# Altium schematic sheet mems.SchDoc
size 431 x 279 mm; Organization: ORGANIZATION; Address1: ADDRESS 1; Address2: ADDRESS 2; Address3: ADDRESS 3; Address4: ADDRESS 4; Revision: -; SheetNumber: 1; SheetTotal: 4; ENG_APP_DATE: --/--/--; DSN_APP_DATE: --/--/--; CHK_APP_DATE: --/--/--
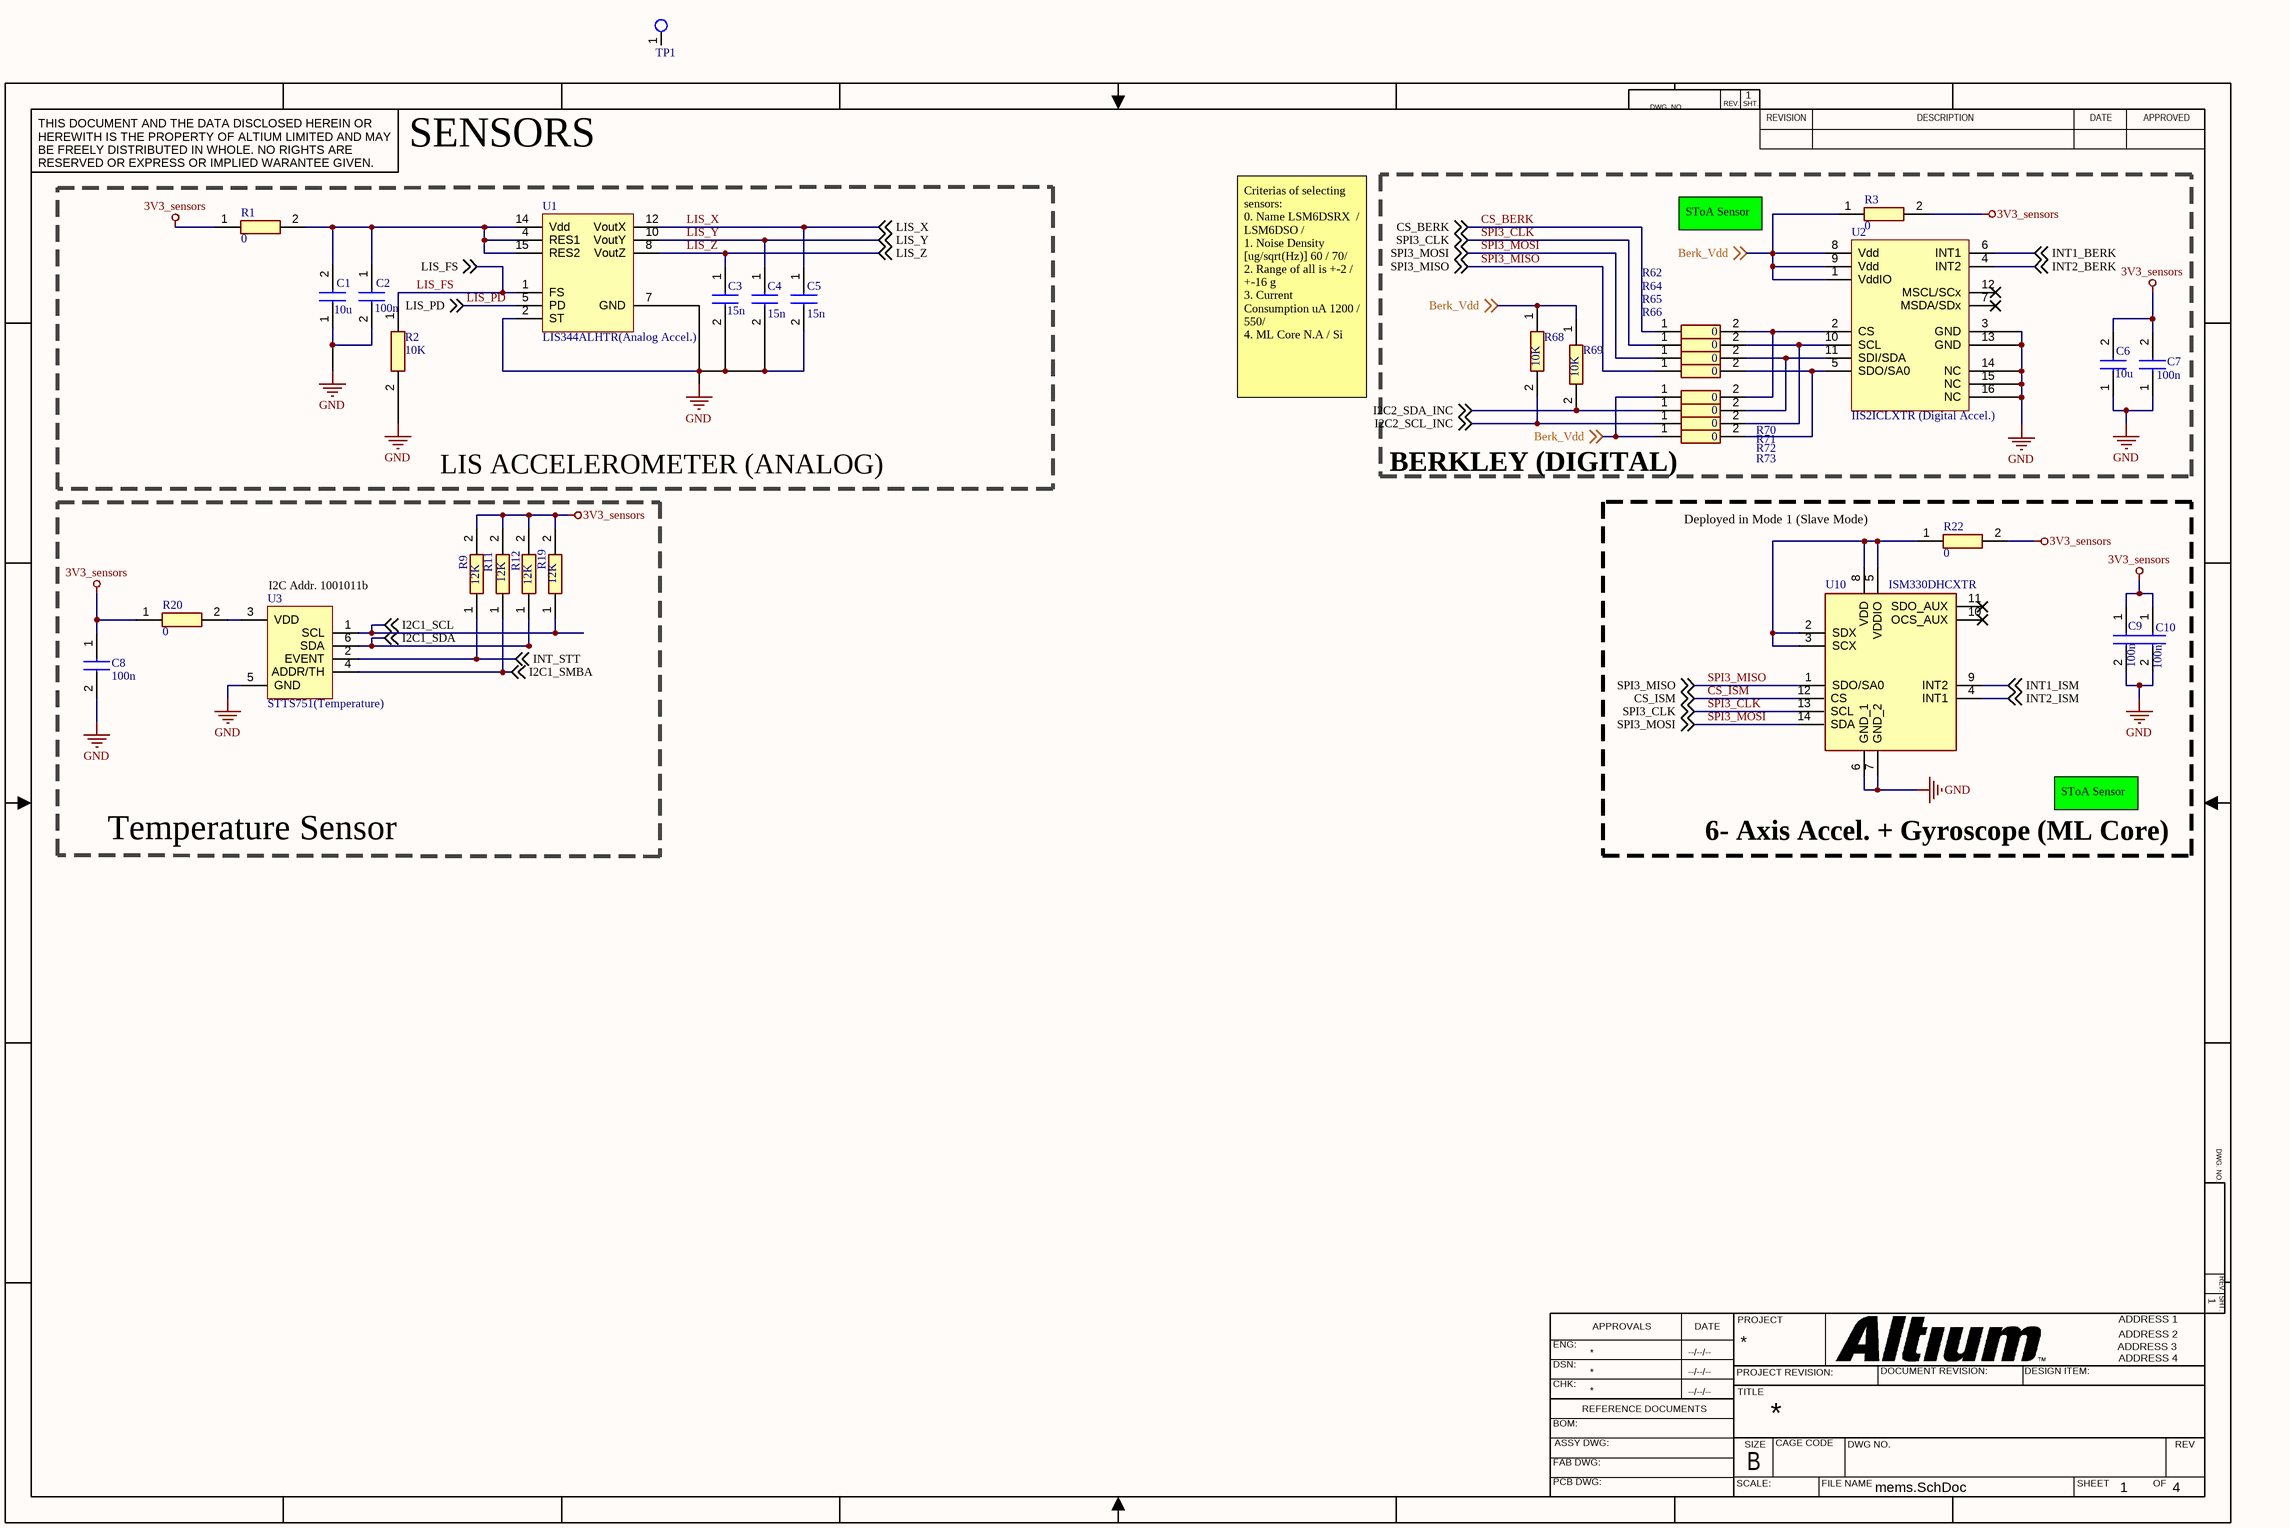
[diagram p0: mems.SchDoc]

## Parts
C1  10u  [CAPC1608X100N]
C2  100n  [CAPC1608X87N]
C3  15n  [CAPC1608X87N]
C4  15n  [CAPC1608X87N]
C5  15n  [CAPC1608X87N]
C6  10u  [CAPC1608X100N]
C7  100n  [CAPC1608X87N]
C8  100n  [CAPC1608X87N]
C9  100n  [CAPC1608X87N]
C10  100n  [CAPC1608X87N]
R1  0  [RESC1608X55N]
R2  10K  [ERJ3EK_(0603)]
R3  0  [RESC1608X55N]
R9  12K  [RESC0603X26N]
R11  12K  [RESC0603X26N]
R12  12K  [RESC0603X26N]
R19  12K  [RESC0603X26N]
R20  0  [RESC1608X55N]
R22  0  [RESC1608X55N]
R62  0  [RESC1608X55N]
R64  0  [RESC1608X55N]
R65  0  [RESC1608X55N]
R66  0  [RESC1608X55N]
R68  10K  [ERJ3EK_(0603)]
R69  10K  [ERJ3EK_(0603)]
R70  0  [RESC1608X55N]
R71  0  [RESC1608X55N]
R72  0  [RESC1608X55N]
R73  0  [RESC1608X55N]
TP1  test_point  [test_point]  (value not drawn)  (no BOM)
U1  LIS344ALHTR(Analog Accel.)  [LGA16R65P4X4_400X400X160]
U2  IIS2ICLXTR (Digital Accel.)  [Berkley]
U3  STTS751(Temperature)  [SOT95P280X145-6N]
U10  ISM330DHCXTR  [LGA-14(2.5X3X0.86)]

## Blocks framed on the sheet
LIS ACCELEROMETER (ANALOG): C1-C5 R1 R2 U1
BERKLEY (DIGITAL): C6 C7 R3 R62 R64-R66 R68-R73 U2
Temperature Sensor: C8 R9 R11 R12 R19 R20 U3
6- Axis Accel. + Gyroscope (ML Core): C9 C10 R22 U10

## Nets
3V3_sensors: C6.2 C7.2 C8.1 C9.1 C10.1 R1.1 R3.2 R9.2 R11.2 R12.2 R19.2 R20.1 R22.2
GND: C1.1 C2.2 C3.2 C4.2 C5.2 C6.1 C7.1 C8.2 C9.2 C10.2 R2.2 U1.2(ST) U1.7(GND) U2.3(GND) U2.13(GND) U2.14(NC) U2.15(NC) U2.16(NC) U3.5(GND) U10.6(GND_1) U10.7(GND_2)
Berk_Vdd: R3.1 R68.1 R69.1 R70.1 R73.1 U2.1(VddIO) U2.8(Vdd) U2.9(Vdd) ; off-sheet Berk_Vdd
CS_BERK: R62.1 ; off-sheet CS_BERK
CS_ISM: U10.12(CS) ; off-sheet CS_ISM
I2C1_SCL: R19.1 U3.1(SCL) ; off-sheet I2C1_SCL
I2C1_SDA: R12.1 U3.6(SDA) ; off-sheet I2C1_SDA
I2C1_SMBA: R11.1 U3.4(ADDR/TH) ; off-sheet I2C1_SMBA
I2C2_SCL_INC: R68.2 R72.1 ; off-sheet I2C2_SCL_INC
I2C2_SDA_INC: R69.2 R71.1 ; off-sheet I2C2_SDA_INC
INT1_BERK: U2.6(INT1) ; off-sheet INT1_BERK
INT1_ISM: U10.9(INT2) ; off-sheet INT1_ISM
INT2_BERK: U2.4(INT2) ; off-sheet INT2_BERK
INT2_ISM: U10.4(INT1) ; off-sheet INT2_ISM
INT_STT: R9.1 U3.2(EVENT) ; off-sheet INT_STT
LIS_FS: R2.1 U1.1(FS) ; off-sheet LIS_FS
LIS_PD: U1.5(PD) ; off-sheet LIS_PD
LIS_X: C5.1 U1.12(VoutX) ; off-sheet LIS_X
LIS_Y: C4.1 U1.10(VoutY) ; off-sheet LIS_Y
LIS_Z: C3.1 U1.8(VoutZ) ; off-sheet LIS_Z
SPI3_CLK: R64.1 U10.13(SCL) ; off-sheet SPI3_CLK
SPI3_MISO: R66.1 U10.1(SDO/SA0) ; off-sheet SPI3_MISO
SPI3_MOSI: R65.1 U10.14(SDA) ; off-sheet SPI3_MOSI
NetC1_2: C1.2 C2.1 R1.2 U1.4(RES1) U1.14(Vdd) U1.15(RES2)
NetR20_2: R20.2 U3.3(VDD)
NetR22_1: R22.1 U10.2(SDX) U10.3(SCX) U10.5(VDDIO) U10.8(VDD)
NetR62_2: R62.2 R70.2 U2.2(CS)
NetR64_2: R64.2 R72.2 U2.10(SCL)
NetR65_2: R65.2 R71.2 U2.11(SDI/SDA)
NetR66_2: R66.2 R73.2 U2.5(SDO/SA0)

Not connected (* = marked no-connect by the designer): TP1 1(TP); U2 7(MSDA/SDx)* 12(MSCL/SCx)*; U10 10(OCS_AUX)* 11(SDO_AUX)*

## Notes on the sheet
- SENSORS
- SToA Sensor
- Criterias of selecting sensors:
  0. Name LSM6DSRX  / LSM6DSO /
  1. Noise Density [ug/sqrt(Hz)] 60 / 70/
  2. Range of all is +-2 / +-16 g
  3. Current Consumption uA 1200 / 550/
  4. ML Core N.A / Si
- Deployed in Mode 1 (Slave Mode)
- (near U3) I2C Addr. 1001011b
- It is an event detection pin. It will trigger to 0 when temperature is below or equal to low level threshold or higher than an upper boundary.
- This pin has 2 tasks:
  1. Define the address of the I2C slave for the sensor. Sensor's address is based on the pull-up resistor indicated in Table 1 of datasheet. If it is connected to GND, address would be 76h (111 0110b).
  2. Drops to zero when temperature exceeds the THerm limit in register 20h. This pin can either be connected to an MCU (an external interrupt), or to an external Fan to cool down the system.
- DWG. NO.
- REV.
- SHT.
- THIS DOCUMENT AND THE DATA DISCLOSED HEREIN OR HEREWITH IS THE PROPERTY OF ALTIUM LIMITED AND MAY BE FREELY DISTRIBUTED IN WHOLE. NO RIGHTS ARE RESERVED OR EXPRESS OR IMPLIED WARANTEE GIVEN.
- REVISION
- DESCRIPTION
- DATE
- APPROVED
- ENG:
- APPROVALS
- PROJECT
- DSN:
- CHK:
- REFERENCE DOCUMENTS
- PROJECT REVISION:
- TITLE
- DOCUMENT REVISION:
- DESIGN ITEM:
- BOM:
- FAB DWG:
- PCB DWG:
- ASSY DWG:
- SCALE:
- SIZE
- B
- CAGE CODE
- FILE NAME
- DWG NO.
- SHEET
- OF
- REV

## Library data of the parts
C1 C6 = LMK107BBJ106KALT: Capacitor; Manufacturer_Name: TAIYO YUDEN; Datasheet Link: https://componentsearchengine.com//LMK107BBJ106KALT.pdf; Height: 1mm; Mouser2 Part Number: 963-LMK107BBJ106KALT; Mouser2 Price/Stock: https://www.mouser.com/Search/Refine.aspx?Keyword=963-LMK107BBJ106KALT; Manufacturer_Part_Number: LMK107BBJ106KALT
C2 C7-C10 = 885012206071: Capacitor; Manufacturer_Name: Wurth Elektronik; Datasheet Link: https://katalog.we-online.com/pbs/datasheet/885012206071.pdf; Height: 0.87mm; Manufacturer_Part_Number: 885012206071
C3-C5 = 885012206041: Capacitor; Manufacturer_Name: Wurth Elektronik; Datasheet Link: https://katalog.we-online.com/pbs/datasheet/885012206041.pdf; Height: 0.87mm; Manufacturer_Part_Number: 885012206041
R1 R3 R20 R22 R62 R64-R66 R70-R73 = RC0603FR-070RL: Resistor; Manufacturer_Name: YAGEO (PHYCOMP); Height: 0.55mm; Manufacturer_Part_Number: RC0603FR-070RL
R2 R68 R69 = ERJ-3EKF1002V: Resistor; Manufacturer_Name: Panasonic; Datasheet Link: https://componentsearchengine.com//ERJ-3EKF1002V.pdf; Height: 0.55mm; Mouser2 Part Number: 667-ERJ-3EKF1002V; Mouser2 Price/Stock: https://www.mouser.com/Search/Refine.aspx?Keyword=667-ERJ-3EKF1002V; Manufacturer_Part_Number: ERJ-3EKF1002V
R9 R11 R12 R19 = ERJ-1RHD1202C: Resistor; Manufacturer_Name: Panasonic; Datasheet Link: https://industrial.panasonic.com/cdbs/www-data/pdf/RDA0000/AOA0000C304.pdf; Height: 0.26mm; Manufacturer_Part_Number: ERJ-1RHD1202C
U1 = LIS344ALHTR: 3-axis analog accelerometer, ±2 g / ±6 g user selectable full-scale, ultra compact, low power; Manufacturer: STMicroelectronics; Max Supply Voltage: 3.6V; Min Supply Voltage: 2.4V; Nominal Supply Current: 680uA; Bandwidth: 2kHz; Sensitivity: 15000mV/g; Axis: X, Y, Z; Supplier 1: Digi-Key; Manufacturer Part Number: LIS344ALHTR; RoHS: Yes; Stock 1: 153; Mount: Surface Mount; Case/Package: LGA; Number of Pins: 16; Contact Plating: Gold; Min Operating Temperature: -40°C; Max Operating Temperature: 85°C; Packaging: Tape and Reel; Package Quantity: 1; Output Type: Analog; Length: 4.15mm; Width: 4.15mm; Height: 1.33mm; Radiation Hardening: No; Lead Free: Lead Free; ComponentLink1URL: https://datasheet.ciiva.com/12174/cd00182781-85334-12174772.pdf?src-supplier=Mouser; ComponentLink1Description: https://datasheet.ciiva.com/12174/cd00182781-85334-12174772.pdf?src-supplier=Mouser; ComponentLink2URL: https://datasheet.ciiva.com/26928/lis344alhtr-26928753.pdf?src-supplier=IIIC; ComponentLink2Description: https://datasheet.ciiva.com/26928/lis344alhtr-26928753.pdf?src-supplier=IIIC; ComponentLink3URL: https://datasheet.ciiva.com/2809/cd00182781-2809847.pdf?src-supplier=Digi-Key; ComponentLink3Description: https://datasheet.ciiva.com/2809/cd00182781-2809847.pdf?src-supplier=Digi-Key; ComponentLink4URL: https://datasheet.ciiva.com/16372/cd00182781-16372423.pdf?src-supplier=Future+Electronics; ComponentLink4Description: https://datasheet.ciiva.com/16372/cd00182781-16372423.pdf?src-supplier=Future+Electronics; ComponentLink5URL: https://datasheet.ciiva.com/2809/cd00182781-2809848.pdf?src-supplier=Digi-Key; ComponentLink5Description: https://datasheet.ciiva.com/2809/cd00182781-2809848.pdf?src-supplier=Digi-Key; ComponentLink6URL: https://datasheet.ciiva.com/2809/cd00182781-2809849.pdf?src-supplier=Digi-Key; ComponentLink6Description: https://datasheet.ciiva.com/2809/cd00182781-2809849.pdf?src-supplier=Digi-Key; ComponentLink7URL: https://datasheet.ciiva.com/16638/cd00182781-16638187.pdf?src-supplier=Avnet+Europe; ComponentLink7Description: https://datasheet.ciiva.com/16638/cd00182781-16638187.pdf?src-supplier=Avnet+Europe; Supplier Part Number 1: 497-6345-1-ND; Category: Sensors
U2 = IIS2ICLXTR: High-accuracy, high-resolution, low-power, 2- axis digital inclinometer; Manufacturer: STMicroelectronics; Supplier 1: Digi-Key; Supplier Part Number 1: 497-IIS2ICLXCT-ND; Manufacturer Part Number: IIS2ICLXTR; RoHS: Yes; Category: Accelerometers; Stock 1: 25
U3 = STTS751-1DP3F: SENSOR TEMPERATURE SMBUS 6UDFN; Manufacturer: STMicroelectronics; Interface: I2C,SMBus,2-Wire,Serial; Resolution: 12b; Output Type: Digital; Max Output Current: 20mA; Min Supply Voltage: 2.25V; Max Supply Voltage: 3.6V; Min Supply Voltage (DC): 2V; Operating Supply Current: 50uA; Supplier 1: RSComponents; Supplier Part Number 1: 1908454; Manufacturer Part Number: STTS751-1DP3F; RoHS: Yes; Category: Sensors; Stock 1: 1; Mount: Surface Mount; Number of Pins: 6; Min Operating Temperature: -40°C; Max Operating Temperature: 125°C; Package Quantity: 3000; Packaging: Tape and Reel; Output Current: 20mA; Max Supply Voltage (DC): 3.6V; Series: STTS751; Radiation Hardening: No; Lead Free: Lead Free; RoHS Compliant: Yes; ComponentLink1URL: https://datasheet.ciiva.com/5299/cd00252523-68863-5299731.pdf?src-supplier=Mouser; ComponentLink1Description: https://datasheet.ciiva.com/5299/cd00252523-68863-5299731.pdf?src-supplier=Mouser; ComponentLink2URL: https://datasheet.ciiva.com/2003/cd00252523-2003053.pdf?src-supplier=Digi-Key; ComponentLink2Description: https://datasheet.ciiva.com/2003/cd00252523-2003053.pdf?src-supplier=Digi-Key; ComponentLink3URL: https://datasheet.ciiva.com/2003/cd00252523-2003054.pdf?src-supplier=Digi-Key; ComponentLink3Description: https://datasheet.ciiva.com/2003/cd00252523-2003054.pdf?src-supplier=Digi-Key; ComponentLink4URL: https://datasheet.ciiva.com/16635/cd00252523-16635462.pdf?src-supplier=Avnet+Europe; ComponentLink4Description: https://datasheet.ciiva.com/16635/cd00252523-16635462.pdf?src-supplier=Avnet+Europe; ComponentLink5URL: https://datasheet.ciiva.com/2003/cd00252523-2003052.pdf?src-supplier=Digi-Key; ComponentLink5Description: https://datasheet.ciiva.com/2003/cd00252523-2003052.pdf?src-supplier=Digi-Key
U10 = ISM330DHCXTR: iNEMO inertial Sensor include 3D accelerometer & 3D gyroscope; LGA-14L package; Manufacturer: STMicroelectronics; Supplier 1: Digi-Key; Supplier Part Number 1: 497-19784-1-ND; Manufacturer Part Number: ISM330DHCXTR; RoHS: Yes; Category: Inertial Measurement Units (IMUs); Stock 1: 9794